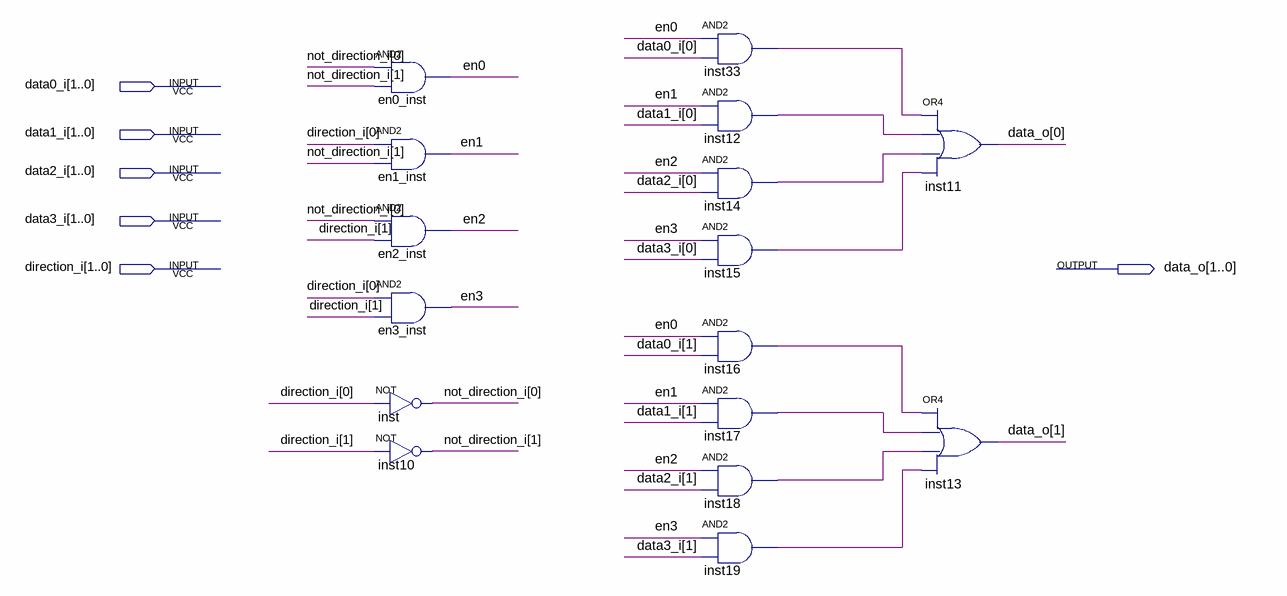
[diagram p0: schematic sheet]
// Quartus schematic mux.bdf as structural Verilog: 16 symbols, 6 pins
module mux (
  input  [1:0] data0_i,
  input  [1:0] data1_i,
  input  [1:0] data2_i,
  input  [1:0] data3_i,
  input  [1:0] direction_i,
  output [1:0] data_o
);

  wire en0, en1, en2, en3, inst12_out, inst14_out, inst15_out, inst16_out, inst17_out, inst18_out,
       inst19_out, inst33_out;
  wire [1:0] not_direction_i;

  and en0_inst (en0, not_direction_i[0], not_direction_i[1]);
  and en1_inst (en1, direction_i[0], not_direction_i[1]);
  and en2_inst (en2, not_direction_i[0], direction_i[1]);
  and en3_inst (en3, direction_i[0], direction_i[1]);
  not inst (not_direction_i[0], direction_i[0]);
  not inst10 (not_direction_i[1], direction_i[1]);
  and inst33 (inst33_out, en0, data0_i[0]);
  and inst12 (inst12_out, en1, data1_i[0]);
  and inst14 (inst14_out, en2, data2_i[0]);
  and inst15 (inst15_out, en3, data3_i[0]);
  and inst16 (inst16_out, en0, data0_i[1]);
  and inst17 (inst17_out, en1, data1_i[1]);
  and inst18 (inst18_out, en2, data2_i[1]);
  and inst19 (inst19_out, en3, data3_i[1]);
  or inst11 (data_o[0], inst33_out, inst12_out, inst14_out, inst15_out);
  or inst13 (data_o[1], inst16_out, inst17_out, inst18_out, inst19_out);
endmodule
